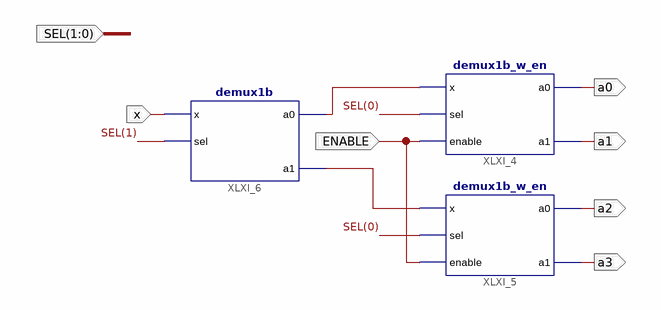
[diagram p0: schematic sheet 1]
// Xilinx ISE schematic demux2b_w_en.sch (artix7) as structural Verilog: 3 symbols, 7 ports
module demux2b_w_en (
  input  [1:0] SEL,
  input  x,
  input  ENABLE,
  output a0,
  output a1,
  output a2,
  output a3
);

  wire XLXN_12, XLXN_13;

  demux1b_w_en XLXI_4 (.x(XLXN_12), .sel(SEL[0]), .enable(ENABLE), .a0(a0), .a1(a1));
  demux1b_w_en XLXI_5 (.x(XLXN_13), .sel(SEL[0]), .enable(ENABLE), .a0(a2), .a1(a3));
  demux1b XLXI_6 (.x(x), .sel(SEL[1]), .a0(XLXN_12), .a1(XLXN_13));
endmodule
